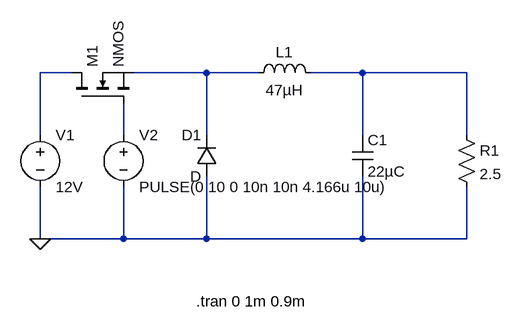
[diagram p0: schematic buck_convertor.asc]
buck_convertor.asc, the LTspice schematic file:
Version 4
SHEET 1 940 680
WIRE 272 272 224 272
WIRE 480 272 368 272
WIRE 560 272 480 272
WIRE 720 272 640 272
WIRE 880 272 720 272
WIRE 224 368 224 272
WIRE 352 368 352 320
WIRE 480 368 480 272
WIRE 720 368 720 272
WIRE 880 368 880 272
WIRE 224 528 224 448
WIRE 352 528 352 448
WIRE 352 528 224 528
WIRE 480 528 480 432
WIRE 480 528 352 528
WIRE 720 528 720 432
WIRE 720 528 480 528
WIRE 880 528 880 448
WIRE 880 528 720 528
FLAG 224 528 0
SYMBOL voltage 224 352 R0
SYMATTR InstName V1
SYMATTR Value 12V
SYMBOL nmos 272 320 R270
SYMATTR InstName M1
SYMBOL diode 496 432 R180
WINDOW 0 24 64 Left 2
WINDOW 3 24 0 Left 2
SYMATTR InstName D1
SYMBOL ind 544 288 R270
WINDOW 0 32 56 VTop 2
WINDOW 3 5 56 VBottom 2
SYMATTR InstName L1
SYMATTR Value 47µH
SYMBOL cap 704 368 R0
SYMATTR InstName C1
SYMATTR Value 22µC
SYMBOL res 864 352 R0
SYMATTR InstName R1
SYMATTR Value 2.5
SYMBOL voltage 352 352 R0
SYMATTR InstName V2
SYMATTR Value PULSE(0 10 0 10n 10n 4.166u 10u)
TEXT 464 624 Left 2 !.tran 0 1m 0.9m

The netlist it stands for:
* buck_convertor.asc
V1 N001 0 12V
M1 N001 N004 N002 N002 NMOS
D1 0 N002 D
L1 N002 N003 47µH
C1 N003 0 22µC
R1 N003 0 2.5
V2 N004 0 PULSE(0 10 0 10n 10n 4.166u 10u)
.model D D
.lib standard.dio
.model NMOS NMOS
.model PMOS PMOS
.lib standard.mos
.tran 0 1m 0.9m
.backanno
.end